# Altium project Oasis_Heater_Testing.PrjPcb
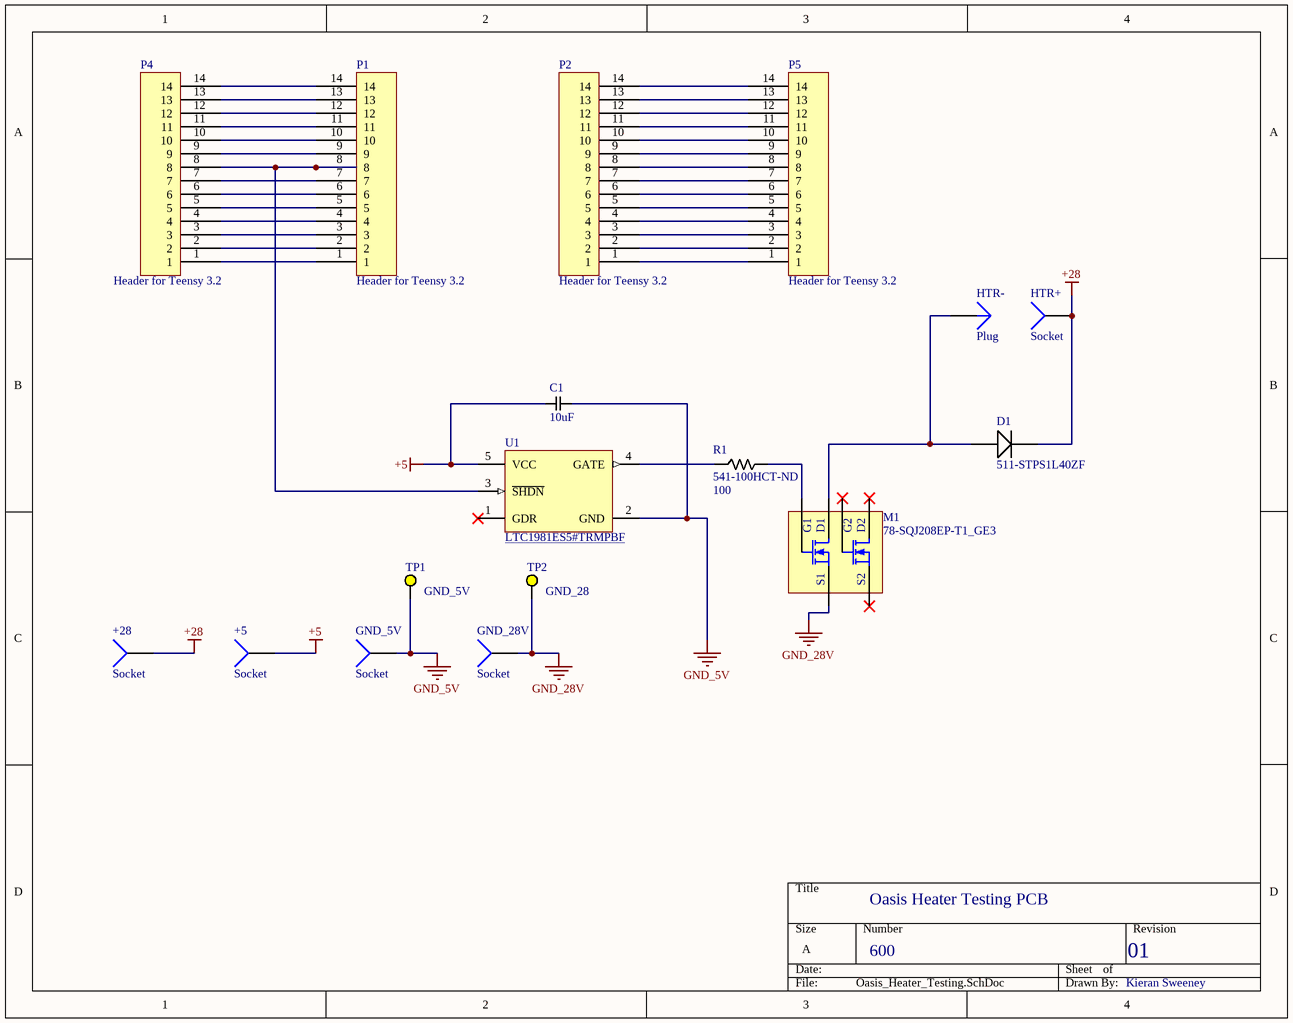
[diagram p0: Oasis_Heater_Testing.SchDoc]
1 sheet, 17 parts. Net scope: global (net labels, ports and power ports of the same name join across sheets).
Board file: Oasis_Heater_Testing_PCB.PcbDoc

## Sheet Oasis_Heater_Testing.SchDoc
size A

### Parts
+5  Socket  [PIN1]
+28  Socket  [PIN1]
C1  value 10uF  [IMPERIAL0805_CAPACITOR]  (hidden comment: 10uF Capacitor)
D1  Supplier Part Number 1: 511-STPS1L40ZF  [*SODFL3718X108N]  (hidden comment: STPS1L40ZF)
GND_5V  Socket  [PIN1]
GND_28V  Socket  [PIN1]
HTR+  Socket  [PIN1]
HTR-  Plug  [PIN1]
M1  Supplier Part Number 1: 78-SQJ208EP-T1_GE3  [PowerPAK SO-8L DUAL ASYMMETRIC]  (hidden comment: NPN MOSFET)
P1  Header for Teensy 3.2  [BL114G]
P2  Header for Teensy 3.2  [BL114G]
P4  Header for Teensy 3.2  [BL114G]
P5  Header for Teensy 3.2  [BL114G]
R1  value 100  Supplier Part Number 1: 541-100HCT-ND  [Imperial0603_RES]  (hidden comment: CRCW0603100RFKEAC)
TP1  GND_5V  [KSTN-5004]
TP2  GND_28  [KSTN-5004]
U1  LTC1981ES5#TRMPBF  [LT-S5-5-SOT-23_N]

### Nets
+5: +5.1 C1.1 U1.5(VCC)
+28: +28.1 D1.1(cathode) HTR+.1
GND_5V: C1.2 GND_5V.1 TP1.1 U1.2(GND)
GND_28V: GND_28V.1 M1.1(S1) TP2.1
NetD1_2: D1.2(anode) HTR-.1 M1.5(D1)
NetM1_2: M1.2(G1) R1.1
NetP1_1: P1.1 P4.1
NetP1_2: P1.2 P4.2
NetP1_3: P1.3 P4.3
NetP1_4: P1.4 P4.4
NetP1_5: P1.5 P4.5
NetP1_6: P1.6 P4.6
NetP1_7: P1.7 P4.7
NetP1_8: P1.8 P4.8 U1.3(~{SHDN})
NetP1_9: P1.9 P4.9
NetP1_10: P1.10 P4.10
NetP1_11: P1.11 P4.11
NetP1_12: P1.12 P4.12
NetP1_13: P1.13 P4.13
NetP1_14: P1.14 P4.14
NetP2_1: P2.1 P5.1
NetP2_2: P2.2 P5.2
NetP2_3: P2.3 P5.3
NetP2_4: P2.4 P5.4
NetP2_5: P2.5 P5.5
NetP2_6: P2.6 P5.6
NetP2_7: P2.7 P5.7
NetP2_8: P2.8 P5.8
NetP2_9: P2.9 P5.9
NetP2_10: P2.10 P5.10
NetP2_11: P2.11 P5.11
NetP2_12: P2.12 P5.12
NetP2_13: P2.13 P5.13
NetP2_14: P2.14 P5.14
NetR1_2: R1.2 U1.4(GATE)

Not connected (* = marked no-connect by the designer): M1 3(S2)* 4(G2)* 6(D2)*; U1 1(GDR)*

### Notes on the sheet
- Oasis Heater Testing PCB
- 600
- 01
- Kieran Sweeney

### Library data of the parts
C1 = C2012X8L1A106K125AE: 10 uF Capacitor; Supplier Part Number: C2012X8L1A106K125AE
D1 = STPS1L40ZF: 1A Schottky Diode; pin to pad: 1>C 2>A; Supplier 1: Mouser
M1 = SQJ208EP-T1_GE3: Two NPN Power Transistors for heater power control; Supplier 1: Mouser
P1 P2 P4 P5 = BL114G: 14-pin header, to be used with Teensy 3.2
R1 = CRCW0603100RFKEAC: 100 Ohm Resistor; Supplier 1: Digi-Key
TP1 TP2 = CMP-2000-05575-1: Test Point, Yellow, 1-Pin THD, RoHS, Bulk; Manufacturer: Keystone; Package Description: 1-Pin Through Hole Device, Dia 2.54 mm; Manufacturer URL: http://www.keyelco.com/; Datasheet Version: Rev. G, 12/2008; Package Reference: 5004; Datasheet URL: http://www.keyelco.com/product-pdf.cfm?p=1313; Mounting Technology: ThroughHole
U1 = CMP-0479-00408-1: Single and Dual Micropower High Side Switch Controller, 1.8 to 5.5 V Vin, 5-pin SOT23 (S5-5), -40 to 85 degC, Pb-Free, Mini Tape and Reel; Manufacturer: Linear Technology; ComponentLink1URL: http://www.linear.com/; ComponentLink3Description: Package Specification; Packing: Mini Tape and Reel; PackageDescription: 5-Pin Plastic SOT-23, Body 1.625 x 2.90 mm, Pitch 0.95 mm; ComponentLink3URL: http://cds.linear.com/docs/en/datasheet/17278fb.pdf; PackageVersion: Aug-07; ComponentLink1Description: Manufacturer URL; PartNumber: LTC1981ES5#TRMPBF; RoHS: TRUE; ComponentLink2URL: http://cds.linear.com/docs/en/datasheet/19812fs.pdf; Mounting Technology: Surface Mount; PackageReference: S5-5; ComponentLink2Description: Datasheet
+5 +28 GND_5V GND_28V HTR+ = Socket: LatestRevisionDate: 17-Jul-2002; LatestRevisionNote: Re-released for DXP Platform.; Publisher: Altium Limited
HTR- = Plug: LatestRevisionDate: 17-Jul-2002; LatestRevisionNote: Re-released for DXP Platform.; Publisher: Altium Limited